# EAGLE design attiny_micro (EAGLE 6.5.0)
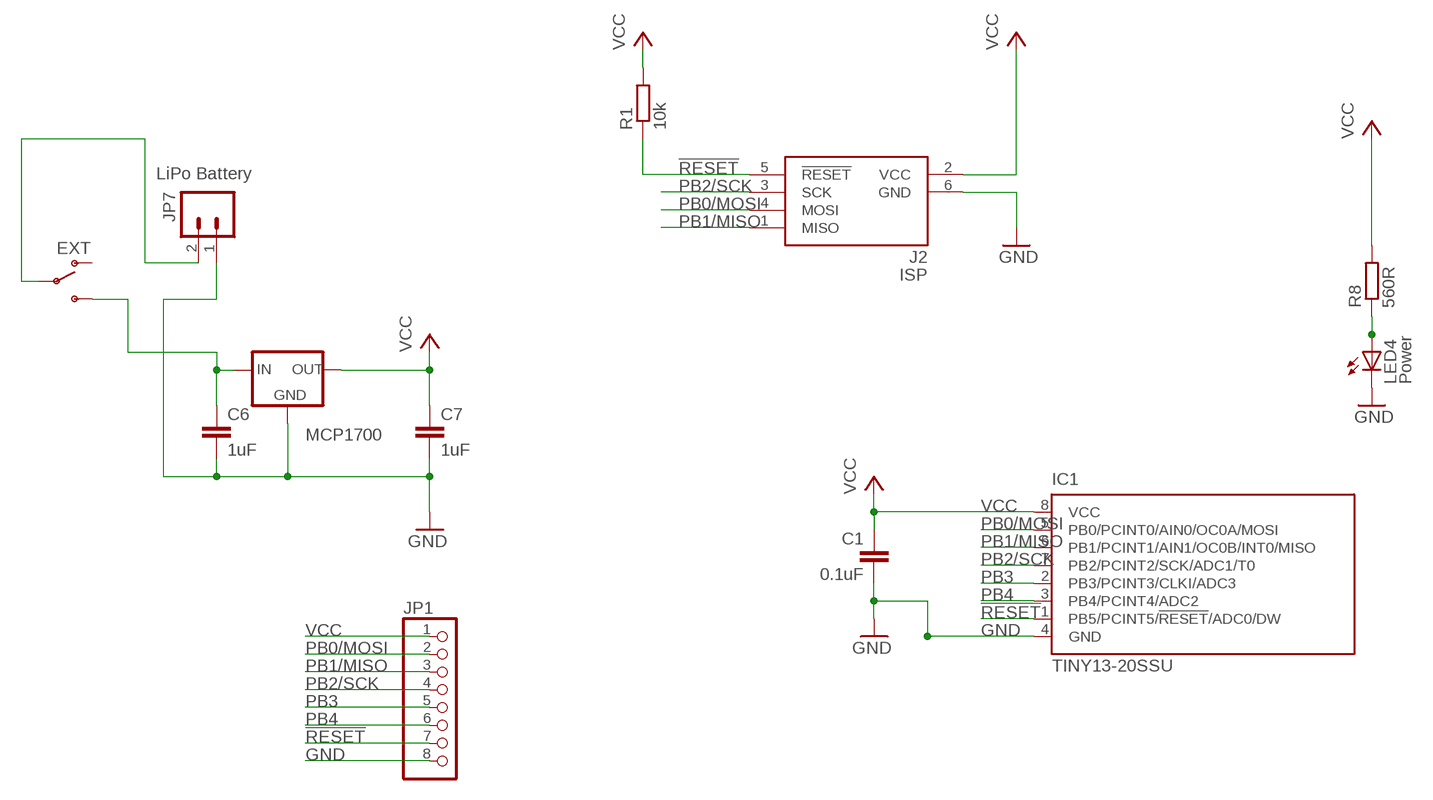
[diagram p0: schematic, sheet 1]

## Parts
C1  0.1uF  C-EUC0805  [C0805]
C6  1uF  C-EUC0805  [C0805]
C7  1uF  C-EUC0805  [C0805]
IC1  TINY13-20SSU  [8S1]
J2  ISP  AVRISP6  [CON6P2R]
JP1  PINHD-1X8  [1X08]
JP7  LiPo Battery  M02JST-PTH-2  [JST-2-PTH]
LED4  Power  LEDCHIP-LED0805  [CHIP-LED0805]
MCP1700  MCP1700  MCP1700SOT-23  [SOT-23]
ON  EXT  SWITCH-SPSTPTH  [SWITCH-SPDT]
R1  10k  R-EU_R0805  [R0805]
R8  560R  R-EU_R0805  [R0805]

## Nets
!RESET: IC1.1(PB5/PCINT5/!RESET!/ADC0/DW) J2.5(!RESET) JP1.7 R1.1
GND [GND]: C1.2 C6.2 C7.2 IC1.4(GND) J2.6(GND) JP1.8 JP7.1 LED4.C MCP1700.1(GND)
N$2: LED4.A R8.1
N$3 [VCC]: JP7.2 ON.2(P)
N$15 [VCC]: C6.1 MCP1700.3(IN) ON.3(S)
PB0/MOSI: IC1.5(PB0/PCINT0/AIN0/OC0A/MOSI) J2.4(MOSI) JP1.2
PB1/MISO: IC1.6(PB1/PCINT1/AIN1/OC0B/INT0/MISO) J2.1(MISO) JP1.3
PB2/SCK: IC1.7(PB2/PCINT2/SCK/ADC1/T0) J2.3(SCK) JP1.4
PB3: IC1.2(PB3/PCINT3/CLKI/ADC3) JP1.5
PB4: IC1.3(PB4/PCINT4/ADC2) JP1.6
VCC [VCC]: C1.1 C7.1 IC1.8(VCC) J2.2(VCC) JP1.1 MCP1700.2(OUT) R1.2 R8.2
Unconnected: ON.1(O)

## Library data of the parts
C1 C6 C7 = resistor:C-EU: CAPACITOR, European symbol
IC1 = atmel:TINY13: 8-bit AVR Microcontroller with 1K Bytes In-System Programmable Flash Source: http://www.atmel.com/dyn/resources/prod_documents/2535S.pdf; MPN: ATTINY13-20SSU; OC_FARNELL: 1455133; OC_NEWARK: 58M3771
J2 = ads4:AVRISP6: 6-pin dual-row connector for Atmel AVRISP programmer interface
JP1 = pinhead:PINHD-1X8: PIN HEADER
JP7 = SparkFun:M02: Header 2 Standard 2-pin 0.1" header. Use with straight break away headers (SKU : PRT-00116), right angle break away headers (PRT-00553), swiss pins (PRT-00743), machine pins (PRT-00117), and female headers (PRT-00115). Molex polarized connector foot print use with SKU : PRT-08233 with associated crimp pins and housings.
LED4 = adafruit:LED: LED OSRAM: - CHIPLED LG R971, LG N971, LY N971, LG Q971, LY Q971, LO R971, LY R971 LH N974, LH R974 LS Q976, LO Q976, LY Q976 LO Q996 - Hyper CHIPLED LW Q18S LB Q993, LB Q99A, LB R99A - SideLED LS A670, LO A670, LY A670, LG A670, LP A670 LB A673, LV A673, LT A673, LW A673 LH A674 LY A675 LS A676, LA A676, LO A676, LY A676, LW A676 LS A679, LY A679, LG A679 - Hyper Micro SIDELED® LS Y876, LA Y876, LO Y876, LY Y876 LT Y87S - SmartLED LW L88C, LW L88S LB L89C, LB L89S, LG L890 LS L89K, LO L89K, LY L89K LS L896, LA L896, LO L896, LY L896 - TOPLED LS T670, LO T670, LY T670, LG T670, LP T670 LSG T670, LSP T670, LSY T670, LOP T670, LYG T670 LG T671, LOG T671, LSG T671 LB T673, LV T673, LT T673, LW T673 LH T674 LS T676, LA T676, LO T676, LY T676, LB T676, LH T676, LSB T676, LW T676 LB T67C, LV T67C, LT T67C, LS T67K, LO T67K, LY T67K, LW E67C LS E67B, LA E67B, LO E67B, LY E67B, LB E67C, LV E67C, LT E67C LW T67C LS T679, LY T679, LG T679 LS T770, LO T770, LY T770, LG T770, LP T770 LB T773, LV T773, LT T773, LW T773 LH T774 LS E675, LA E675, LY E675, LS T675 LS T776, LA T776, LO T776, LY T776, LB T776 LHGB T686 LT T68C, LB T68C - Hyper Mini TOPLED® LB M676 - Mini TOPLED Santana® LG M470 LS M47K, LO M47K, LY M47K Source: http://www.osram.convergy.de/
MCP1700 = MY_IC:MCP1700
ON = SparkFun:SWITCH-SPST: SPST Switch Simple slide switch. Spark Fun Electronics SKU : COM-00102
R1 R8 = resistor:R-EU_: RESISTOR, European symbol

## Net classes
0 default: width 0.305 mm, drill 0.508 mm
1 GND: width 0.61 mm, drill 0.508 mm
2 VCC: width 0.61 mm, drill 0.508 mm

## Board
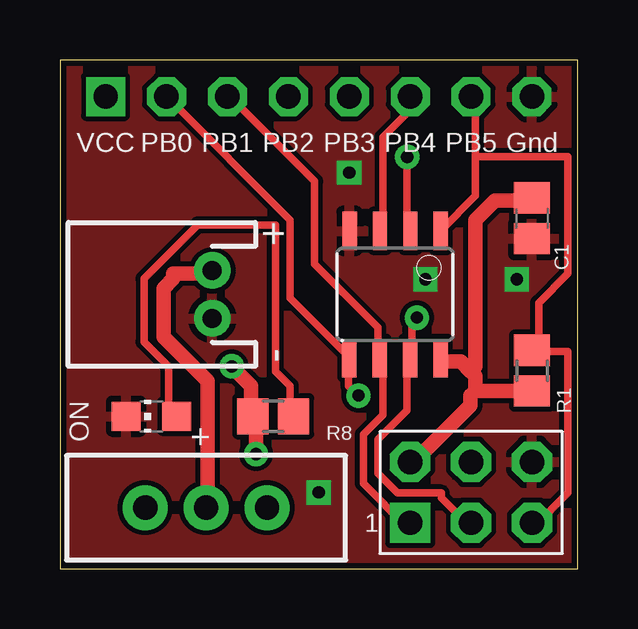
[diagram p1: board, top side]
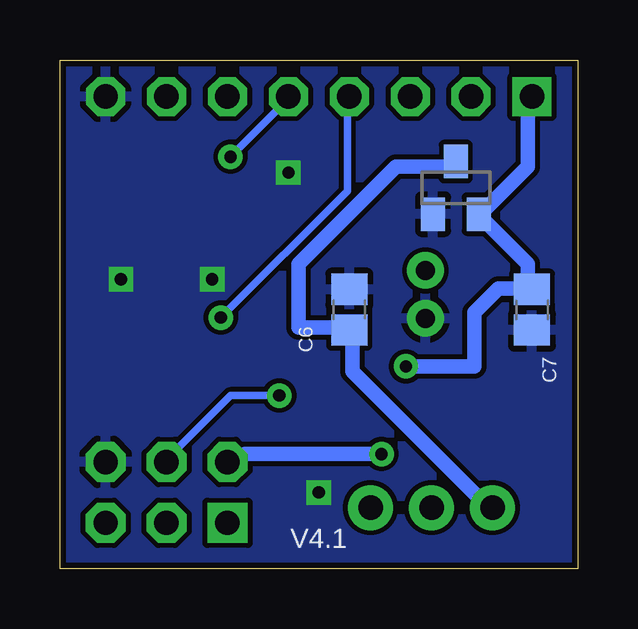
[diagram p2: board, bottom side, seen from below]

Size 21.59 x 21.21 mm. Coordinates in mm from the lower left corner, seen from the top.
Outline: 0,0 21.59,0 21.59,21.21 0,21.21 0,0
Copper layers (1*16): Top 0.035mm / dielectric 1.5mm / Bottom 0.035mm
Design rules "SparkFun *": minimum track width 10mil, minimum drill 20mil, track to track 8mil, track to pad 8mil, pad to pad 8mil, via to via 8mil, smd to smd 8mil, copper to edge 10mil, drill to drill 8mil, minimum pad ring 12mil, minimum via ring 10mil, stop-mask expansion 4mil, vias tented up to drill 25mil, thermal gap 10mil

### Footprints (pad centres in the part's own frame; a part is rotated, then mirrored left to right if it is on the bottom)
C0805 = smd 1.3 x 1.5: 1 -0.85,0; 2 0.85,0
8S1 = smd 0.6 x 1.6: 1 -1.905,-2.654; 2 -0.645,-2.654; 3 0.625,-2.654; 4 1.895,-2.654; 5 1.905,2.654; 6 0.635,2.654; 7 -0.635,2.654; 8 -1.905,2.654
CON6P2R = drill 1.016 pad 1.676 square: 1 -2.54,-1.27 | drill 1.016 pad 1.676 octagon: 2 -2.54,1.27; 3 0,-1.27; 4 0,1.27; 5 2.54,-1.27; 6 2.54,1.27
1X08 = drill 1.016 square: 1 -8.89,0 | drill 1.016 octagon: 2 -6.35,0; 3 -3.81,0; 4 -1.27,0; 5 1.27,0; 6 3.81,0; 7 6.35,0; 8 8.89,0
JST-2-PTH = drill 0.787 pad 1.524: 1 -1,0; 2 1,0
CHIP-LED0805 = smd 1.2 x 1.2: A 0,-1.05; C 0,1.05
SOT-23 = smd 1 x 1.4: 1 -0.95,-1.1; 2 0.95,-1.1; 3 0,1.1
SWITCH-SPDT = drill 1.016 pad 1.88: 1 0,2.54; 2 0,0; 3 0,-2.54
R0805 = smd 1.3 x 1.5: 1 -0.85,0; 2 0.85,0

### Placement (x,y rotation side)
C1  19.69,14.61 270 top
C6  9.53,10.79 90 bottom
C7  1.9,10.79 270 bottom
IC1  13.97,11.43 180 top
J2  17.14,3.17 0 top
JP1  10.79,19.68 0 top
JP7  6.35,11.43 90 top
LED4  3.81,6.35 90 top
MCP1700  5.08,15.88 0 bottom
ON  6.1,2.54 270 top
R1  19.69,8.25 270 top
R8  8.89,6.35 180 top

### Tracks (layer width: path | path; a pad name or v marks a point on that pad's centre or on a via)
!RESET
  Top 0.305: 17.32,17.17 17.32,19.61 JP1.7 | 17.32,17.17 17.32,15.54 15.9,14.12 IC1.1 | 19.96,9.04 21.18,9.04 21.18,3.15 19.76,1.73 J2.5 | 19.96,9.04 19.76,9.04 R1.1 19.96,9.04 | 17.32,17.17 21.18,17.17 21.18,12.29 19.96,11.07 19.96,9.04
GND  (via drill 0.51)
  other vias: 10.79,3.17 15.24,12.06 12.06,16.51 19.05,12.06
  pour Bottom: -0.63,21.59 22.23,21.59 22.23,-0.63 -0.63,-0.63
  pour Top: -0.63,21.59 22.23,21.59 22.23,-0.63 -0.63,-0.63
N$2
  Top 0.305: LED4.A 4.72,6.4 4.52,6.6 4.52,8.43 3.51,9.45 3.51,12.09 5.74,14.33 8.99,14.33 8.99,8.23 9.6,7.62 9.6,6.4 R8.1
N$3
  Top 0.61: JP7.2 6.35,12.29 4.72,12.29 4.72,12.09 4.32,11.68 4.32,9.65 6.15,7.82 6.15,2.54 ON.2
N$15
  Bottom 0.61: MCP1700.3 5.13,16.97 5.33,16.76 7.57,16.76 11.63,12.7 11.63,10.06 9.6,10.06 C6.1 9.4,9.86 9.4,8.23 3.71,2.54 ON.3
PB0/MOSI  (via drill 0.51)
  Top 0.305: JP1.2 4.52,19.61 9.6,14.53 9.6,11.28 12.04,8.84 IC1.5 12.04,8.64 12.04,7.62 v12.45,7.21
  Bottom 0.305: v12.45,7.21 14.48,7.21 17.12,4.57 J2.4
PB1/MISO
  Top 0.305: J2.1 14.48,1.73 12.65,3.56 12.65,5.59 13.46,6.4 13.46,8.64 IC1.6 13.26,8.84 13.26,10.06 10.62,12.7 10.62,16.15 7.16,19.61 JP1.3
PB2/SCK  (via drill 0.51)
  Top 0.305: J2.3 17.12,1.73 15.9,2.95 15.9,3.15 14.07,3.15 13.26,3.96 13.26,5.39 14.48,6.6 14.48,8.64 IC1.7 14.68,8.84 14.68,10.26 v14.88,10.46
  Bottom 0.305: v14.88,10.46 9.6,15.75 9.6,19.61 JP1.4
PB3  (via drill 0.51)
  Top 0.305: v14.48,17.17 14.48,14.12 IC1.2
  Bottom 0.305: v14.48,17.17 12.04,19.61 JP1.5
PB4
  Top 0.305: IC1.3 13.46,14.12 13.46,17.98 14.48,19 14.48,19.61 JP1.6
VCC  (via drill 0.51)
  Top 0.61: v8.18,4.77 8.18,6.2 R8.2 7.98,6.6 7.98,7.62 v7.16,8.43 | J2.2 14.68,4.37 J2.2 | 17.32,7.42 19.56,7.42 R1.2 | 17.32,7.42 17.32,8.03 17.12,8.23 | 17.12,8.23 16.71,8.64 15.9,8.64 IC1.8 | C1.1 19.56,15.34 18.14,15.34 17.32,14.53 17.32,8.43 17.12,8.23 | J2.2 14.88,4.57 17.12,6.81 17.12,7.21 17.32,7.42
  Bottom 0.61: JP1.1 2.08,19.61 2.08,16.76 3.91,14.93 MCP1700.2 4.12,14.73 2.08,12.7 2.08,11.68 C7.1 2.29,11.68 3.3,11.68 4.32,10.67 4.32,8.43 v7.16,8.43 | v8.18,4.77 13.87,4.77 14.07,4.57 14.48,4.57 J2.2

### Text on the board
tNames: VCC | PB0 | PB1 | PB2 | PB3 | PB4 | PB5 | Gnd | + | - | 1
bNames: V4.1